# EAGLE schematic atmega328 (EAGLE 9.6.2)
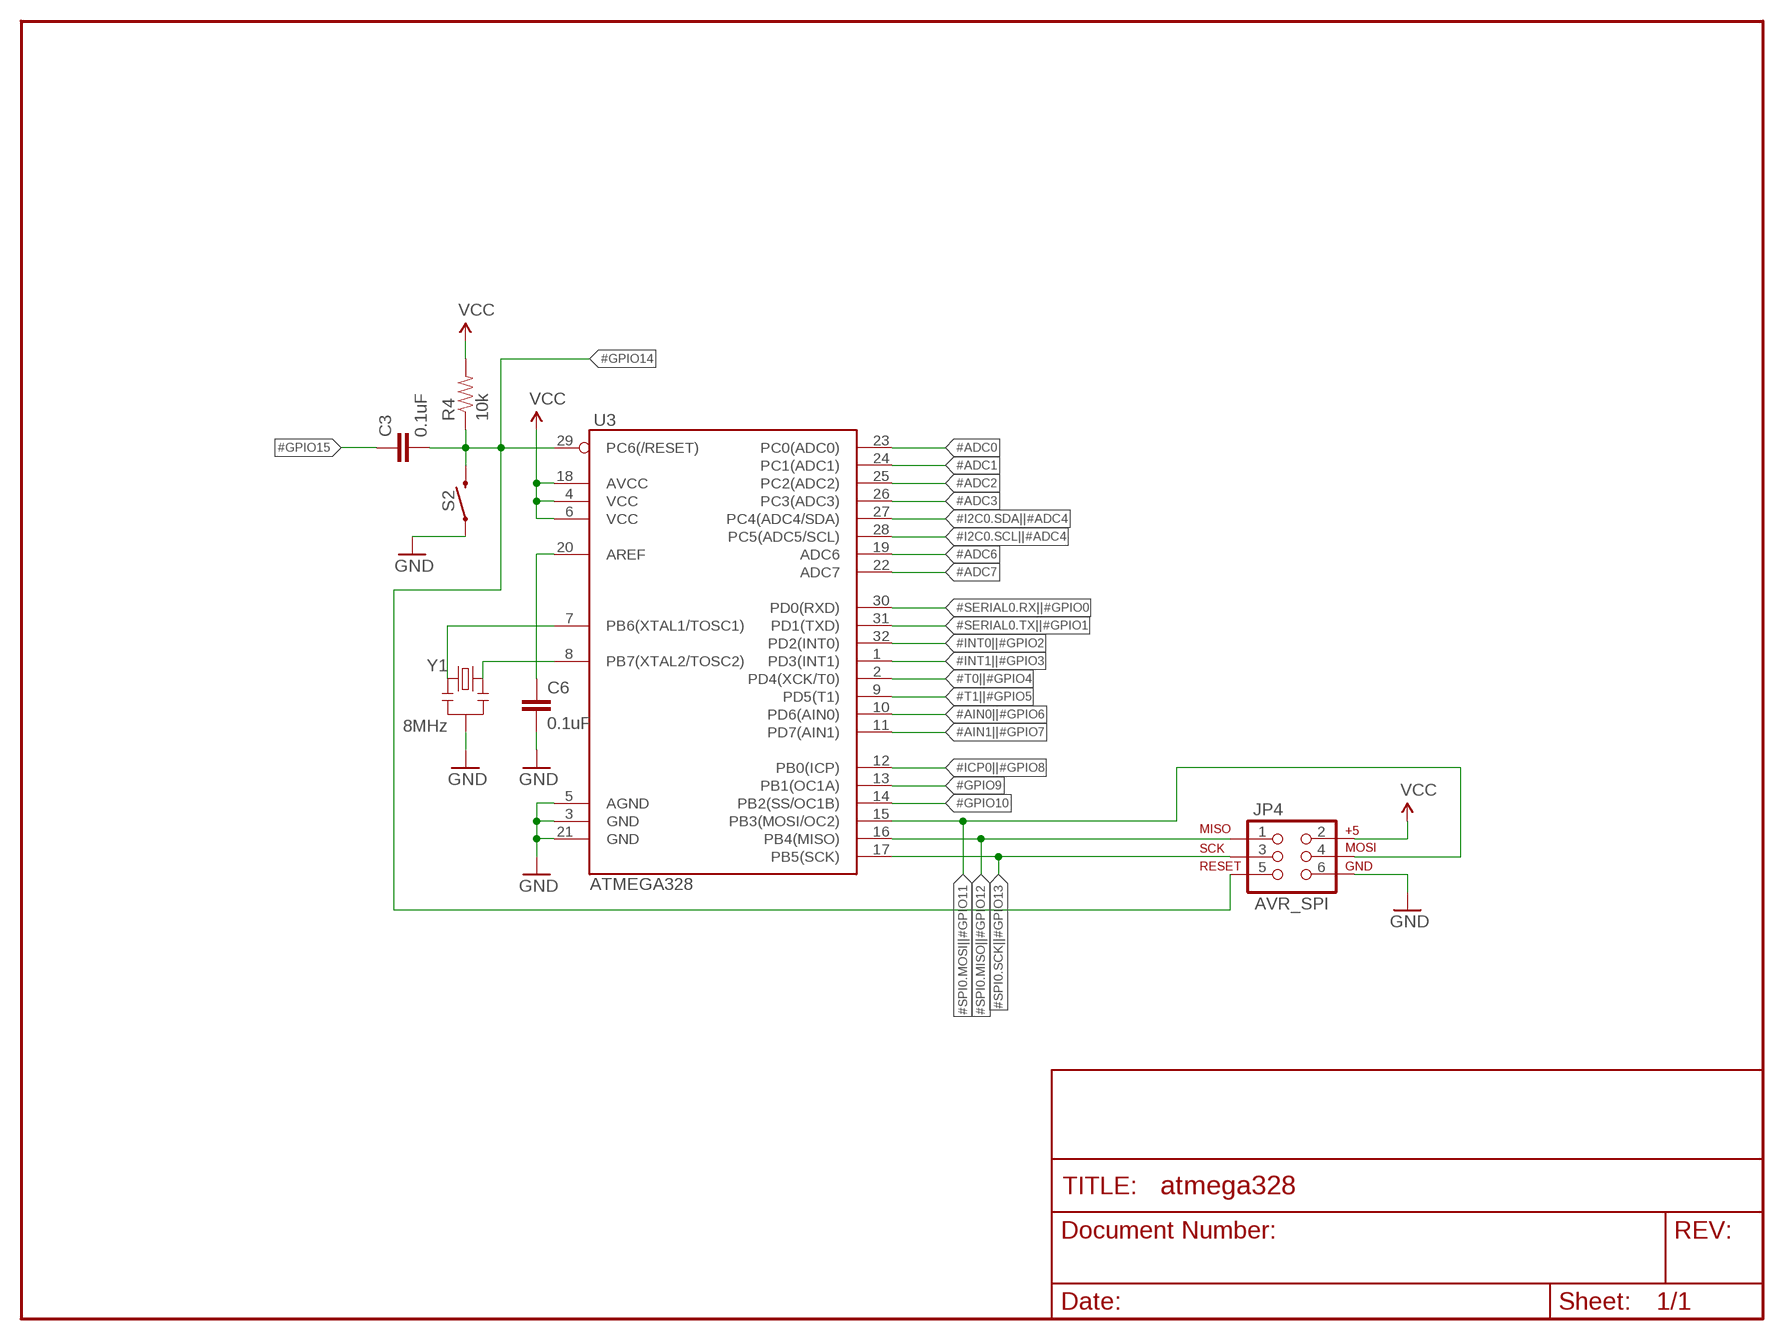
[diagram p0: schematic, sheet 1]

## Parts
C3  0.1uF  0.1UF-0603-25V-5%  [0603]
C6  0.1uF  0.1UF-0603-25V-5%  [0603]
JP4  AVR_SPI  AVR_SPI_PRG_6PTH  [2X3]
R4  10k  10KOHM-0603-1/10W-1%  [0603]
S2  MOMENTARY-SWITCH-SPST-SMD-6.2MM-TALL  [TACTILE_SWITCH_SMD_6.2MM_TALL]
U3  ATMEGA328  ATMEGA168  [TQFP32-08]
Y1  8MHz  RESONATORSMD  [RESONATOR-SMD]

## Nets
#ADC0: U3.23(PC0(ADC0))
#ADC1: U3.24(PC1(ADC1))
#ADC2: U3.25(PC2(ADC2))
#ADC3: U3.26(PC3(ADC3))
#ADC6: U3.19(ADC6)
#ADC7: U3.22(ADC7)
#AIN0||#GPIO6: U3.10(PD6(AIN0))
#AIN1||#GPIO7: U3.11(PD7(AIN1))
#GPIO9: U3.13(PB1(OC1A))
#GPIO10: U3.14(PB2(SS/OC1B))
#GPIO14: C3.2 JP4.5 R4.1 S2.B2 U3.29(PC6(/RESET))
#GPIO15: C3.1
#I2C0.SCL||#ADC4: U3.28(PC5(ADC5/SCL))
#I2C0.SDA||#ADC4: U3.27(PC4(ADC4/SDA))
#ICP0||#GPIO8: U3.12(PB0(ICP))
#INT0||#GPIO2: U3.32(PD2(INT0))
#INT1||#GPIO3: U3.1(PD3(INT1))
#SERIAL0.RX||#GPIO0: U3.30(PD0(RXD))
#SERIAL0.TX||#GPIO1: U3.31(PD1(TXD))
#SPI0.MISO||#GPIO12: JP4.1 U3.16(PB4(MISO))
#SPI0.MOSI||#GPIO11: JP4.4 U3.15(PB3(MOSI/OC2))
#SPI0.SCK||#GPIO13: JP4.3 U3.17(PB5(SCK))
#T0||#GPIO4: U3.2(PD4(XCK/T0))
#T1||#GPIO5: U3.9(PD5(T1))
AREF: C6.1 U3.20(AREF)
GND: C6.2 JP4.6 S2.A2 U3.3(GND) U3.5(AGND) U3.21(GND) Y1.2
N$10: U3.7(PB6(XTAL1/TOSC1)) Y1.3
N$12: U3.8(PB7(XTAL2/TOSC2)) Y1.1
VCC [VCC]: JP4.2 R4.2 U3.4(VCC) U3.6(VCC) U3.18(AVCC)

## Library data of the parts
C3 C6 = SparkFun-Capacitors:0.1UF: 0.1µF ceramic capacitors A capacitor is a passive two-terminal electrical component used to store electrical energy temporarily in an electric field.; PROD_ID: CAP-08604
JP4 = SparkFun:AVR_SPI_PRG_6: AVR ISP 6 Pin This is the reduced ISP connector for AVR programming. Common on Arduino. This footprint will take up less PCB space and can be used with a 10-pin to 6-pin adapter such as SKU: BOB-08508
R4 = SparkFun-Resistors:10KOHM: 10kΩ resistor A resistor is a passive two-terminal electrical component that implements electrical resistance as a circuit element. Resistors act to reduce current flow, and, at the same time, act to lower voltage levels within circuits. - Wikipedia; PROD_ID: RES-00824
S2 = SparkFun-Switches:MOMENTARY-SWITCH-SPST: Momentary Switch (Pushbutton) - SPST Normally-open (NO) SPST momentary switches (buttons, pushbuttons). Variants PTH-12MM - 12mm square, through-hole Momentary Pushbutton Switch - 12mm Square <https://www.sparkfun.com/products/9190> (COM-09190) PTH-6.0MM, PTH-6.0MM-KIT - 6.0mm square, through-hole Mini Pushbutton Switch <https://www.sparkfun.com/products/97> (COM-00097) KIT package intended for soldering kit's - only one side of pads' copper is exposed. PTH-RIGHT-ANGLE-KIT - Right-angle, through-hole Right Angle Tactile Button <https://www.sparkfun.com/products/10791> - Used on SparkFun BigTime Watch Kit <https://www.sparkfun.com/products/11734> SMD-12MM - 12mm square, surface-mount Tactile Button - SMD (12mm) <https://www.sparkfun.com/products/12993> (COM-12993) Used on SparkFun PicoBoard <https://www.sparkfun.com/products/11888> SMD-4.5MM - 4.5mm Square Trackball Switch Used on SparkFun Blackberry Trackballer Breakout <https://www.sparkfun.com/products/13169> SMD-4.6MMX2.8MM - 4.60mm x 2.80mm, surface mount Used on SparkFun SAMD21 Mini Breakout <https://www.sparkfun.com/products/13664> SMD-5.2MM, SMD-5.2-REDUNDANT - 5.2mm square, surface-mount Mini Pushbutton Switch - SMD <https://www.sparkfun.com/products/8720> (COM-08720) Used on Arduino Pro Mini <https://www.sparkfun.com/products/11114> REDUNDANT package connects both switch circuits together SMD-6.0X3.5MM - 6.0 x 3.5mm, surface mount Momentary Reset Switch SMD <https://www.sparkfun.com/products/8229> (COM-08229) SMD-6.2MM-TALL - 6.2mm square, surface mount Tactile Button - SMD (6mm) <https://www.sparkfun.com/products/12992> Used on SparkFun Digital Sandbox <https://www.sparkfun.com/products/12651> SMD-RIGHT-ANGLE - Right-angle, surface mount Used on SparkFun Block for Intel® Edison - Arduino <https://www.sparkfun.com/products/13036>; PROD_ID: SWCH-11966; SF_SKU: COM-12992
U3 = SparkFun:ATMEGA168
Y1 = SparkFun:RESONATOR: Resonator Small SMD resonator. This is the itty bitty 10/20MHz resonators with built in caps. CSTCE10M0G55 and CSTCE20M0V53. Footprint has been reviewed closely but hasn't been tested yet.

## Net classes
1 VCC: width 0.381 mm